# Altium schematic sheet drvoutput3.SchDoc
size A4
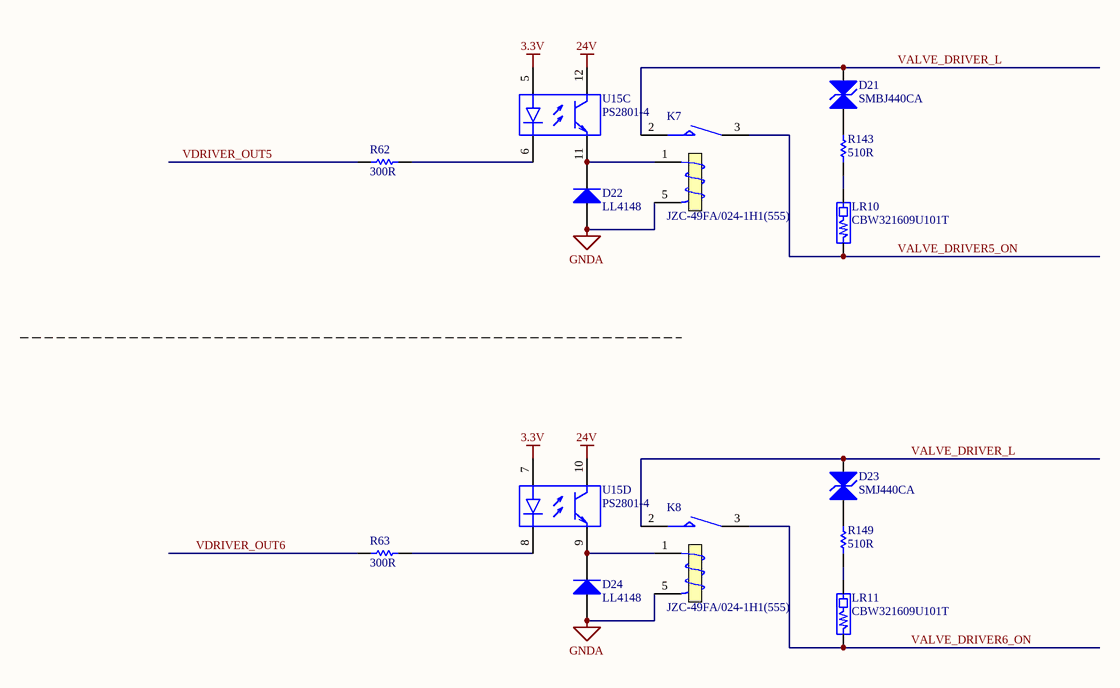
[diagram p0: drvoutput3.SchDoc]

## Parts
D21  SMBJ440CA  [SMB]
D22  LL4148  [CD2012-0805]
D23  SMJ440CA  [SMB]
D24  LL4148  [CD2012-0805]
K7  JZC-49FA/024-1H1(555)  [JZC-49FA]
K8  JZC-49FA/024-1H1(555)  [JZC-49FA]
LR10  CBW321609U101T  [INDC3216M]
LR11  CBW321609U101T  [INDC3216M]
R62  300R  [RESC2012M]
R63  300R  [RESC2012M]
R143  510R  [RESC3216M]
R149  510R  [RESC3216M]
U15  PS2801-4  [SOIC16_N]  (parts C,D of 4)

## Nets
3.3V: U15.5(+) U15.7(+)
24V: U15.10(C) U15.12(C)
GNDA: D22.1(A) D24.1(A) K7.5(T2) K8.5(T2)
VALVE_DRIVER5_ON: K7.3(NO) LR10.1
VALVE_DRIVER6_ON: K8.3(NO) LR11.1
VALVE_DRIVER_L: D21.2(K) D23.2(K) K7.2(COM) K8.2(COM)
VDRIVER_OUT5: R62.1
VDRIVER_OUT6: R63.1
NetD21_1: D21.1(A) R143.2
NetD22_2: D22.2(K) K7.1 U15.11(E)
NetD23_1: D23.1(A) R149.2
NetD24_2: D24.2(K) K8.1 U15.9(E)
NetLR10_2: LR10.2 R143.1
NetLR11_2: LR11.2 R149.1
NetR62_2: R62.2 U15.6(-)
NetR63_2: R63.2 U15.8(-)

## Library data of the parts
D21 D23 = Bi-dir TVS Diode: Published: 8-Jun-2000; LatestRevisionDate: 17-Jul-2002; LatestRevisionNote: Re-released for DXP Platform.; PackageReference: DIODE-0.7; Publisher: Altium Limited
D22 D24 = Diode 1N4007: 1 Amp General Purpose Rectifier; Published: 8-Jun-2000; LatestRevisionDate: 17-Jul-2002; LatestRevisionNote: Re-released for DXP Platform.; DatasheetVersion: 1998; PackageVersion: Aug-1999; PackageReference: DO-41; Publisher: Altium Limited; Code_JEDEC: DO-204-AL; ComponentLink1Description: Manufacturer Link; ComponentLink1URL: http://www.fairchildsemi.com/; ComponentLink2Description: Datasheet; ComponentLink2URL: http://www.fairchildsemi.com/ds/1N%2F1N4001.pdf
K7 K8 = JZC-49FA: Intermediate  Power  Relay; Published: 8-Jun-2000; LatestRevisionDate: 17-Jul-2002; LatestRevisionNote: Re-released for DXP Platform.; PackageReference: MODULE5B; Publisher: Altium Limited
LR10 LR11 = BLM10/11/21/31/41: EMI FILTERS,DC Resistance max.0.05~1.5 ohms,10 ~ 1000 ohms at 100MHz  Frequency
R62 R63 = Res1: Resistor; Value: 10K; Published: 8-Jun-2000; LatestRevisionDate: 17-Jul-2002; LatestRevisionNote: Re-released for DXP Platform.; PackageReference: AXIAL-0.3; Publisher: Altium Limited
R143 R149 = Res1: Metal film Resistor; Value: 10K; Published: 8-Jun-2000; LatestRevisionDate: 17-Jul-2002; LatestRevisionNote: Re-released for DXP Platform.; PackageReference: AXIAL-0.3; Publisher: Altium Limited
U15 = PS2801-4: The PS2801-1 and PS2801-4 are optically coupled isolators containing a GaAs light emitting diode and an NPN  silicon phototransistor in a plastic SOP for high density applications.; Published: 28-Feb-2003; LatestRevisionDate: 13-Apr-2006; LatestRevisionNote: IPC-7351 Footprint Added.; DatasheetVersion: Jan-2002, Rev. 7; PackageVersion: rev7, Jan-2002; PackageReference: 751-07; Publisher: Altium Limited; PackageDescription: 8-Pin Plastic Small Outline Integrated Circuit 1.27 mm Pitch; Code_JEDEC: MS-012-AA; Code_IPC: SOIC127P600-8; ComponentLink1Description: Manufacturer Link; ComponentLink1URL: http://www.onsemi.com/; ComponentLink2Description: Datasheet; ComponentLink2URL: http://www.onsemi.com/pub/Collateral/LM358-D.PDF